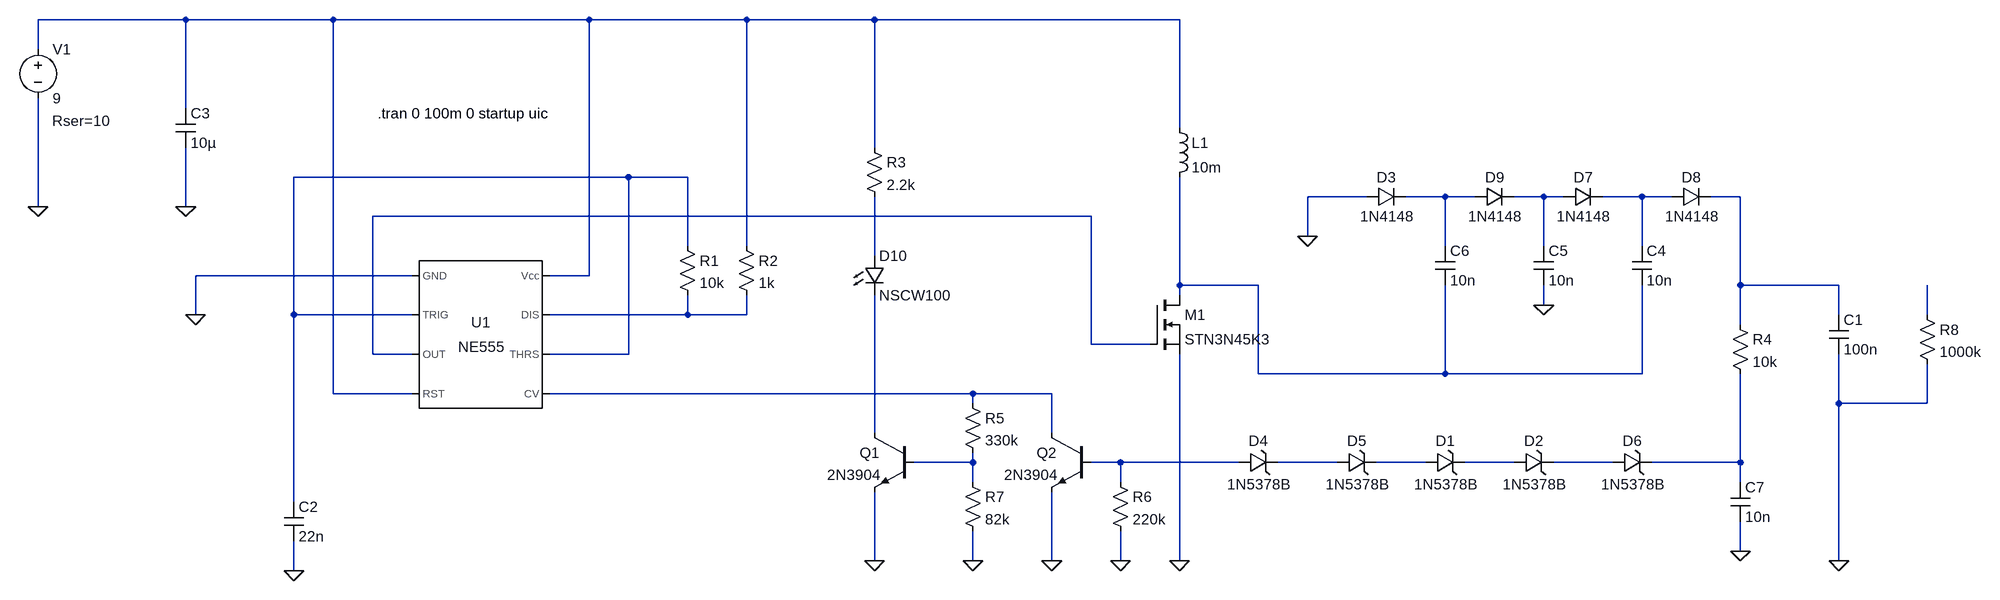
[diagram p0: schematic hv-power-supply-450v.asc]
hv-power-supply-450v.asc, the LTspice schematic file:
Version 4
SHEET 1 3732 680
WIRE -320 -352 -560 -352
WIRE -80 -352 -320 -352
WIRE 336 -352 -80 -352
WIRE 592 -352 336 -352
WIRE 800 -352 592 -352
WIRE 1296 -352 800 -352
WIRE -560 -304 -560 -352
WIRE -320 -208 -320 -352
WIRE 1296 -176 1296 -352
WIRE 800 -144 800 -352
WIRE 400 -96 -144 -96
WIRE 496 -96 400 -96
WIRE 1600 -64 1504 -64
WIRE 1728 -64 1664 -64
WIRE 1776 -64 1728 -64
WIRE 1888 -64 1840 -64
WIRE 1920 -64 1888 -64
WIRE 2048 -64 1984 -64
WIRE 2096 -64 2048 -64
WIRE 2208 -64 2160 -64
WIRE -560 -48 -560 -224
WIRE -320 -48 -320 -144
WIRE 1152 -32 -16 -32
WIRE 1504 0 1504 -64
WIRE 496 16 496 -96
WIRE 592 16 592 -352
WIRE 1728 16 1728 -64
WIRE 1888 16 1888 -64
WIRE 2048 16 2048 -64
WIRE 800 32 800 -64
WIRE 48 64 -304 64
WIRE 336 64 336 -352
WIRE 336 64 272 64
WIRE 1296 80 1296 -96
WIRE 1424 80 1296 80
WIRE 2208 80 2208 -64
WIRE 2368 80 2208 80
WIRE 1296 96 1296 80
WIRE 1888 112 1888 80
WIRE -304 128 -304 64
WIRE -144 128 -144 -96
WIRE 48 128 -144 128
WIRE 496 128 496 96
WIRE 496 128 272 128
WIRE 592 128 592 96
WIRE 592 128 496 128
WIRE 2368 128 2368 80
WIRE 2512 128 2512 80
WIRE 2208 144 2208 80
WIRE 1152 176 1152 -32
WIRE 1248 176 1152 176
WIRE -16 192 -16 -32
WIRE 48 192 -16 192
WIRE 400 192 400 -96
WIRE 400 192 272 192
WIRE 1424 224 1424 80
WIRE 1728 224 1728 80
WIRE 1728 224 1424 224
WIRE 2048 224 2048 80
WIRE 2048 224 1728 224
WIRE -80 256 -80 -352
WIRE 48 256 -80 256
WIRE 960 256 272 256
WIRE 1088 256 960 256
WIRE 960 272 960 256
WIRE 2368 272 2368 192
WIRE 2512 272 2512 208
WIRE 2512 272 2368 272
WIRE 800 320 800 96
WIRE 1088 320 1088 256
WIRE 960 368 960 352
WIRE 960 368 864 368
WIRE 1200 368 1152 368
WIRE 1392 368 1200 368
WIRE 1552 368 1456 368
WIRE 1696 368 1616 368
WIRE 1840 368 1760 368
WIRE 2000 368 1904 368
WIRE 2208 368 2208 224
WIRE 2208 368 2064 368
WIRE 960 400 960 368
WIRE 1200 400 1200 368
WIRE 2208 400 2208 368
WIRE -144 432 -144 128
WIRE 2208 512 2208 464
WIRE 800 528 800 416
WIRE 960 528 960 480
WIRE 1088 528 1088 416
WIRE 1200 528 1200 480
WIRE 1296 528 1296 192
WIRE 2368 528 2368 272
WIRE -144 544 -144 496
FLAG -560 -48 0
FLAG -304 128 0
FLAG 1296 528 0
FLAG 2368 528 0
FLAG -144 544 0
FLAG -320 -48 0
FLAG 800 528 0
FLAG 1504 0 0
FLAG 1888 112 0
FLAG 1088 528 0
FLAG 2208 512 0
FLAG 1200 528 0
FLAG 960 528 0
SYMBOL Misc\\NE555 160 160 R0
SYMATTR InstName U1
SYMBOL voltage -560 -320 R0
WINDOW 123 0 0 Left 0
WINDOW 39 23 132 Left 2
SYMATTR SpiceLine Rser=10
SYMATTR InstName V1
SYMATTR Value 9
SYMBOL nmos 1248 96 R0
SYMATTR InstName M1
SYMATTR Value STN3N45K3
SYMBOL ind 1280 -192 R0
SYMATTR InstName L1
SYMATTR Value 10m
SYMATTR SpiceLine Ipk=250m Rser=14.6 Rpar=0 Cpar=0
SYMBOL cap 2352 128 R0
SYMATTR InstName C1
SYMATTR Value 100n
SYMATTR SpiceLine Rser=1u Lser=1n Rpar=10G
SYMBOL res 480 0 R0
SYMATTR InstName R1
SYMATTR Value 10k
SYMBOL res 576 0 R0
SYMATTR InstName R2
SYMATTR Value 1k
SYMBOL cap -160 432 R0
SYMATTR InstName C2
SYMATTR Value 22n
SYMBOL cap -336 -208 R0
SYMATTR InstName C3
SYMATTR Value 10µ
SYMBOL npn 864 320 M0
SYMATTR InstName Q1
SYMATTR Value 2N3904
SYMBOL zener 1392 384 R270
WINDOW 0 36 32 VTop 2
WINDOW 3 -4 32 VBottom 2
SYMATTR InstName D4
SYMATTR Value 1N5378B
SYMBOL res 2192 128 R0
SYMATTR InstName R4
SYMATTR Value 10k
SYMBOL zener 1552 384 R270
WINDOW 0 36 32 VTop 2
WINDOW 3 -4 32 VBottom 2
SYMATTR InstName D5
SYMATTR Value 1N5378B
SYMBOL diode 1600 -48 R270
WINDOW 0 32 32 VTop 2
WINDOW 3 0 32 VBottom 2
SYMATTR InstName D3
SYMATTR Value 1N4148
SYMBOL diode 1776 -48 R270
WINDOW 0 32 32 VTop 2
WINDOW 3 0 32 VBottom 2
SYMATTR InstName D9
SYMATTR Value 1N4148
SYMBOL cap 1712 16 R0
SYMATTR InstName C6
SYMATTR Value 10n
SYMBOL zener 1696 384 R270
WINDOW 0 36 32 VTop 2
WINDOW 3 -4 32 VBottom 2
SYMATTR InstName D1
SYMATTR Value 1N5378B
SYMBOL zener 1840 384 R270
WINDOW 0 36 32 VTop 2
WINDOW 3 -4 32 VBottom 2
SYMATTR InstName D2
SYMATTR Value 1N5378B
SYMBOL zener 2000 384 R270
WINDOW 0 36 32 VTop 2
WINDOW 3 -4 32 VBottom 2
SYMATTR InstName D6
SYMATTR Value 1N5378B
SYMBOL diode 1920 -48 R270
WINDOW 0 32 32 VTop 2
WINDOW 3 0 32 VBottom 2
SYMATTR InstName D7
SYMATTR Value 1N4148
SYMBOL diode 2096 -48 R270
WINDOW 0 32 32 VTop 2
WINDOW 3 0 32 VBottom 2
SYMATTR InstName D8
SYMATTR Value 1N4148
SYMBOL cap 2032 16 R0
SYMATTR InstName C4
SYMATTR Value 10n
SYMBOL cap 1872 16 R0
SYMATTR InstName C5
SYMATTR Value 10n
SYMBOL npn 1152 320 M0
SYMATTR InstName Q2
SYMATTR Value 2N3904
SYMBOL LED 784 32 R0
SYMATTR InstName D10
SYMATTR Value NSCW100
SYMBOL res 784 -160 R0
SYMATTR InstName R3
SYMATTR Value 2.2k
SYMBOL cap 2192 400 R0
SYMATTR InstName C7
SYMATTR Value 10n
SYMBOL res 1184 384 R0
SYMATTR InstName R6
SYMATTR Value 220k
SYMBOL res 944 256 R0
SYMATTR InstName R5
SYMATTR Value 330k
SYMBOL res 944 384 R0
SYMATTR InstName R7
SYMATTR Value 82k
SYMBOL res 2496 112 R0
SYMATTR InstName R8
SYMATTR Value 1000k
TEXT -8 -200 Left 2 !.tran 0 100m 0 startup uic

The netlist it stands for:
* hv-power-supply-450v.asc
XU1 0 N002 N007 N001 N012 N002 N010 N001 NE555  ; pins GND TRIG OUT RST CV THRS DIS Vcc
V1 N001 0 9 Rser=10
M1 N009 N007 0 0 STN3N45K3
L1 N001 N009 10m Ipk=250m Rser=14.6 Rpar=0 Cpar=0
C1 N006 0 100n Rser=1u Lser=1n Rpar=10G
R1 N002 N010 10k
R2 N001 N010 1k
C2 N002 0 22n
C3 N001 0 10µ
Q1 N013 N014 0 0 2N3904
D4 N015 N016 1N5378B
R4 N006 N020 10k
D5 N016 N017 1N5378B
D3 0 N003 1N4148
D9 N003 N004 1N4148
C6 N003 N009 10n
D1 N017 N018 1N5378B
D2 N018 N019 1N5378B
D6 N019 N020 1N5378B
D7 N004 N005 1N4148
D8 N005 N006 1N4148
C4 N005 N009 10n
C5 N004 0 10n
Q2 N012 N015 0 0 2N3904
D10 N008 N013 NSCW100
R3 N001 N008 2.2k
C7 N020 0 10n
R6 N015 0 220k
R5 N012 N014 330k
R7 N014 0 82k
R8 N011 0 1000k
.model D D
.lib standard.dio
.model NPN NPN
.model PNP PNP
.lib standard.bjt
.model NMOS NMOS
.model PMOS PMOS
.lib standard.mos
.tran 0 100m 0 startup uic
.lib NE555.sub
.backanno
.end